# EAGLE schematic PRC-16105-AFC-1V1 (EAGLE 7.6.0)
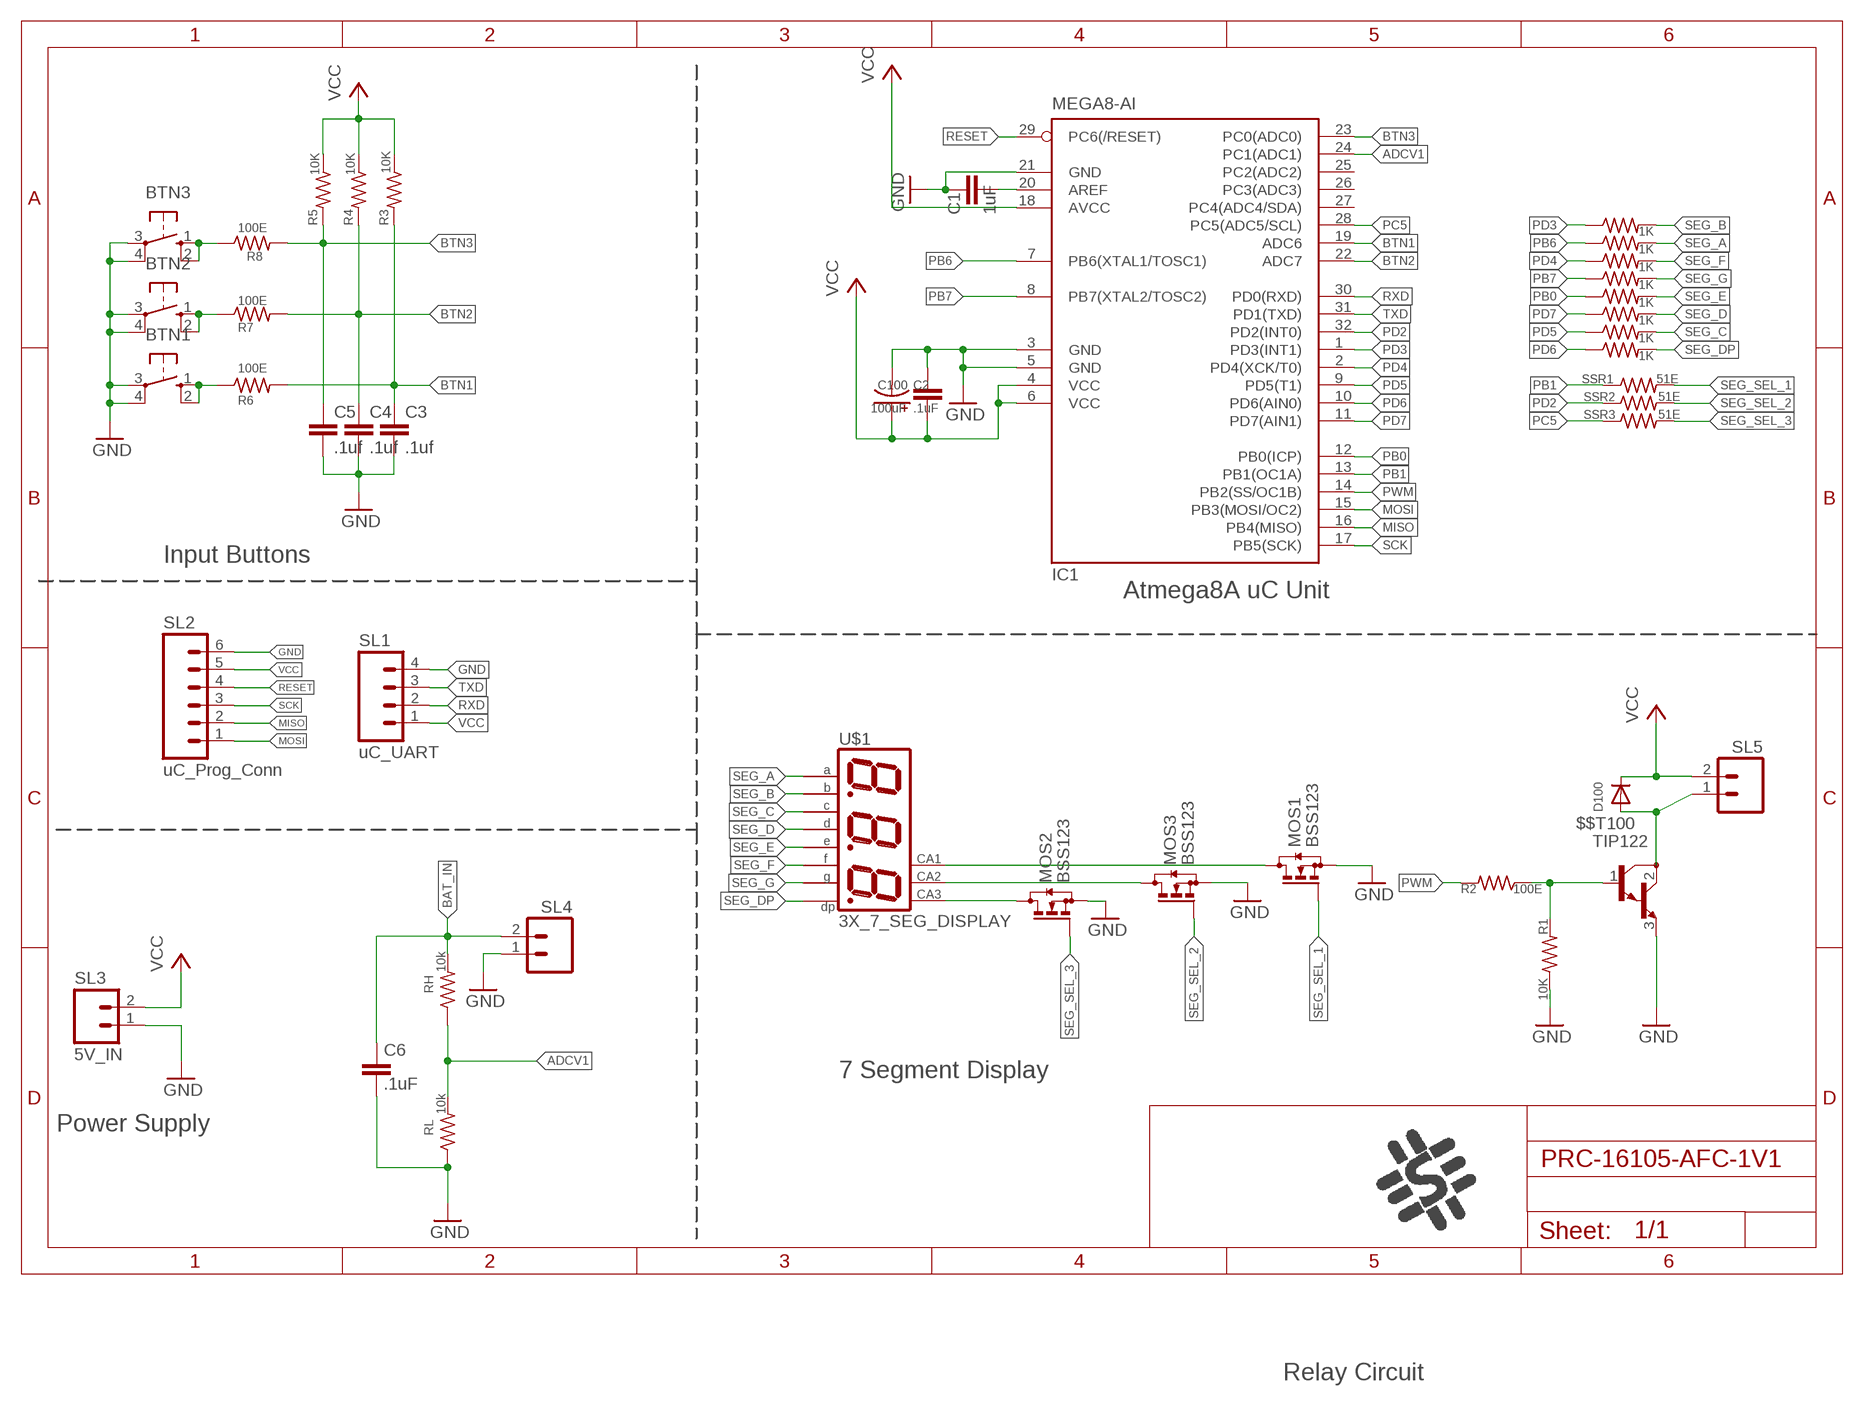
[diagram p0: schematic, sheet 1]

## Parts
$$T100  TIP122  [TO220]
BTN1  10-XX  [B3F-10XX]
BTN2  10-XX  [B3F-10XX]
BTN3  10-XX  [B3F-10XX]
C1  1uF  C-EUC0603K  [C0603K]
C2  .1uF  C-EUC0603K  [C0603K]
C3  .1uf  C-EUC0603K  [C0603K]
C4  .1uf  C-EUC0603K  [C0603K]
C5  .1uf  C-EUC0603K  [C0603K]
C6  .1uF  C-EUC0603K  [C0603K]
C100  100uF  CPOL-US153CLV-0807  [153CLV-0807]
D100  DIODESMA  [SMADIODE]
IC1  MEGA8-AI  [TQFP32-08]
LOGO100  SC_LOGO  [SC_LOGO]
MOS1  BSS123  [SOT23]
MOS2  BSS123  [SOT23]
MOS3  BSS123  [SOT23]
R1  10K  R-US_R0603  [R0603]
R2  100E  R-US_R0603  [R0603]
R3  10K  R-US_R0603  [R0603]
R4  10K  R-US_R0603  [R0603]
R5  10K  R-US_R0603  [R0603]
R6  100E  R-US_R0603  [R0603]
R7  100E  R-US_R0603  [R0603]
R8  100E  R-US_R0603  [R0603]
RB1  1K  R-US_R0603  [R0603]
RB2  1K  R-US_R0603  [R0603]
RB3  1K  R-US_R0603  [R0603]
RB4  1K  R-US_R0603  [R0603]
RB5  1K  R-US_R0603  [R0603]
RB6  1K  R-US_R0603  [R0603]
RB7  1K  R-US_R0603  [R0603]
RB8  1K  R-US_R0603  [R0603]
RH  10k  R-US_R0603  [R0603]
RL  10k  R-US_R0603  [R0603]
SL1  uC_UART  M04  [04P]
SL2  uC_Prog_Conn  M06  [06P]
SL3  5V_IN  M02  [02P]
SL4  M02  [02P]
SL5  M02  [02P]
SSR1  51E  R-US_R0603  [R0603]
SSR2  51E  R-US_R0603  [R0603]
SSR3  51E  R-US_R0603  [R0603]
U$1  3X_7_SEG_DISPLAY  [SP36012CR]

## Nets
ADCV1: IC1.24(PC1(ADC1)) RH.1 RL.2
BAT_IN: C6.1 RH.2 SL4.2
BTN1: C3.1 IC1.19(ADC6) R3.2 R6.2
BTN2: C4.1 IC1.22(ADC7) R4.2 R7.2
BTN3: C5.1 IC1.23(PC0(ADC0)) R5.2 R8.2
GND: $$T100.3(E) BTN1.3(P) BTN1.4(P1) BTN2.3(P) BTN2.4(P1) BTN3.3(P) BTN3.4(P1) C1.1 C2.2 C3.2 C4.2 C5.2 C6.2 C100.- IC1.3(GND) IC1.5(GND) IC1.21(GND) MOS1.2(S) MOS2.2(S) MOS3.2(S) R1.1 RL.1 SL1.4 SL2.6 SL3.1 SL4.1
MISO: IC1.16(PB4(MISO)) SL2.2
MOSI: IC1.15(PB3(MOSI/OC2)) SL2.1
N$1: BTN1.1(S) BTN1.2(S1) R6.1
N$2: BTN2.1(S) BTN2.2(S1) R7.1
N$3: BTN3.1(S) BTN3.2(S1) R8.1
N$5: C1.2 IC1.20(AREF)
N$34: MOS1.3(D) U$1.12(CA)
N$35: MOS3.3(D) U$1.9(CA)
N$36: MOS2.3(D) U$1.8(CA)
N$41: $$T100.1(B) R1.2 R2.1
N$46: $$T100.2(C) D100.A SL5.1
PB0: IC1.12(PB0(ICP)) RB1.1
PB1: IC1.13(PB1(OC1A)) SSR1.1
PB6: IC1.7(PB6(XTAL1/TOSC1)) RB6.1
PB7: IC1.8(PB7(XTAL2/TOSC2)) RB5.1
PC5: IC1.28(PC5(ADC5/SCL)) SSR3.1
PD2: IC1.32(PD2(INT0)) SSR2.1
PD3: IC1.1(PD3(INT1)) RB8.1
PD4: IC1.2(PD4(XCK/T0)) RB7.1
PD5: IC1.9(PD5(T1)) RB4.1
PD6: IC1.10(PD6(AIN0)) RB3.1
PD7: IC1.11(PD7(AIN1)) RB2.1
PWM: IC1.14(PB2(SS/OC1B)) R2.2
RESET: IC1.29(PC6(/RESET)) SL2.4
RXD: IC1.30(PD0(RXD)) SL1.2
SCK: IC1.17(PB5(SCK)) SL2.3
SEG_A: RB6.2 U$1.11(A)
SEG_B: RB8.2 U$1.7(B)
SEG_C: RB4.2 U$1.4(C)
SEG_D: RB2.2 U$1.2(D)
SEG_DP: RB3.2 U$1.3(DP)
SEG_E: RB1.2 U$1.1(E)
SEG_F: RB7.2 U$1.10(F)
SEG_G: RB5.2 U$1.5(G)
SEG_SEL_1: MOS1.1(G) SSR1.2
SEG_SEL_2: MOS3.1(G) SSR2.2
SEG_SEL_3: MOS2.1(G) SSR3.2
TXD: IC1.31(PD1(TXD)) SL1.3
VCC: C2.1 C100.+ D100.C IC1.4(VCC) IC1.6(VCC) IC1.18(AVCC) R3.1 R4.1 R5.1 SL1.1 SL2.5 SL3.2 SL5.2
Unconnected: IC1.25(PC2(ADC2)) IC1.26(PC3(ADC3)) IC1.27(PC4(ADC4/SDA))

## Notes on the sheet
- Input Buttons
- Atmega8A uC Unit
- 7 Segment Display
- Power Supply
- Relay Circuit

## Library data of the parts
$$T100 = transistor:TIP122: NPN BIPOLAR DARLINGTON TRANSISTOR
BTN1-BTN3 = switch-omron:10-XX: OMRON SWITCH; MPN: B3F-1000; OC_FARNELL: 176432; OC_NEWARK: 36M3542
C1 C3-C5 = resistor:C-EU: CAPACITOR, European symbol
C2 C6 = rcl:C-EU: CAPACITOR, European symbol
C100 = adafruit:CPOL-US: POLARIZED CAPACITOR, American symbol
D100 = adafruit:DIODE: Diode SMADIODE - SMA Surface Mount Package 20V 1A Schottky Diode Digikey: 641-1014-6-ND DO-1N4148 - Through Hole Small Current Diode SOD-123 20V 1 A (.5mV Vf) Schottky Diode - Digikey: MBRX120TPMSCT-ND SOD-323 10V 570mA (.38mV Vf, 3ns) Schottky Diode - Digikey: ZLLS410CT-ND SOD-523 30V 30mA Schottky Diode (RB751S-40TE61) - Digikey: RB751S-40TE61CT-ND SOT23-R/W - SOT23 Package (R = Solder Paste/Reflow Ovens, W = Hand-Soldering) BAT54Film 40V 300mA - Digikey: 497-7162-1-ND
IC1 = atmel:MEGA8: MICROCONTROLLER 8 Kbytes FLASH, 1 kbytes SRAM, 512 bytes EEPROM, USART, 6-channel 10 bit ADC, 2-channel 8 bit ADC Pin compatible with Atmega48, ATMega88, ATMega168 Source: avr.lbr; MPN: ATMEGA8-16AU; OC_FARNELL: 9171371; OC_NEWARK: 73M8863
LOGO100 = _SoftCircuits_logo:SC_LOGO; SIZE: 150DPI
MOS1-MOS3 = transistor-small-signal:BSS123: N-CHANNEL MOS FET
R1-R8 RB1-RB8 RH RL SSR1-SSR3 = resistor:R-US_: RESISTOR, American symbol
SL1 = con-amp-quick:M04: AMP QUICK CONNECTOR; OC_FARNELL: unknown; OC_NEWARK: unknown
SL2 = con-amp-quick:M06: AMP QUICK CONNECTOR; OC_FARNELL: unknown; OC_NEWARK: unknown
SL3-SL5 = con-amp-quick:M02: AMP QUICK CONNECTOR; OC_FARNELL: unknown; OC_NEWARK: unknown
U$1 = 7 segment displays:3X_7_SEG_DISPLAY